# EAGLE design PecanFemto3 (EAGLE 7.3.0)
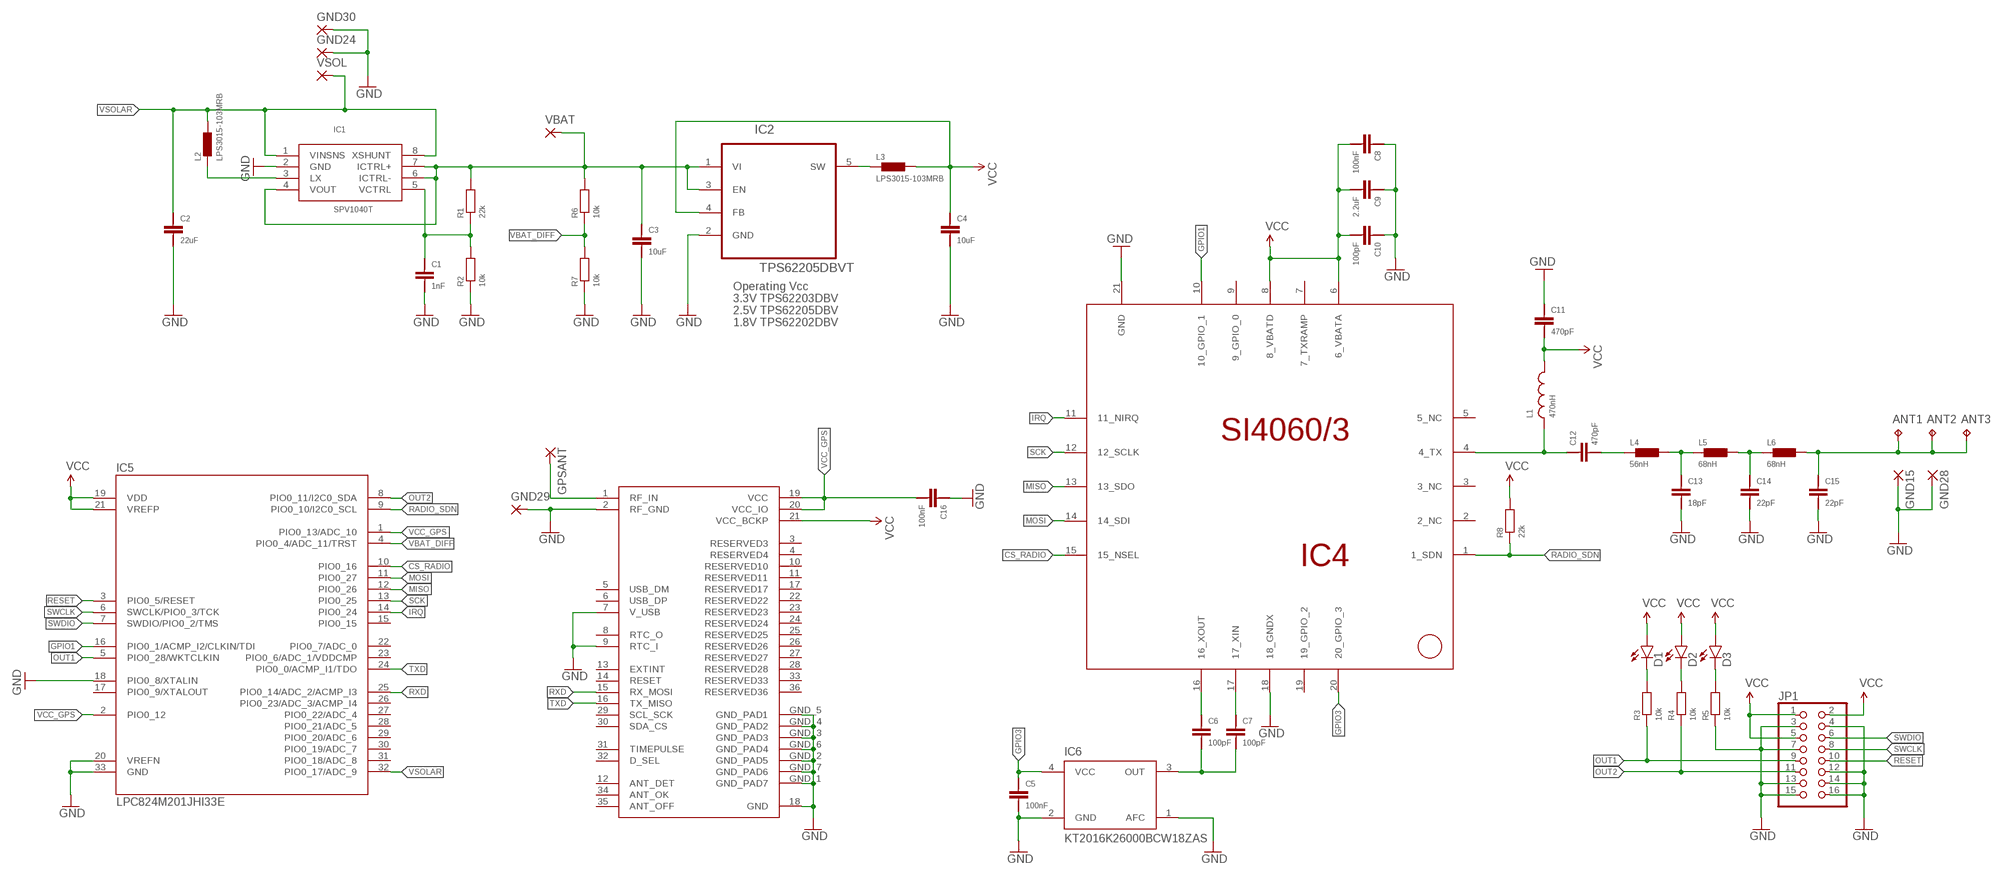
[diagram p0: schematic, sheet 1]

## Parts
ANT1  TP  [P1-7]
ANT2  TP  [P1-7]
ANT3  TP  [P1-7]
C1  1nF  CAP-0402  [0402]
C2  22uF  CAP-0805  [0805]
C3  10uF  CAP-0805  [0805]
C4  10uF  CAP-0805  [0805]
C5  100nF  CAP-0402  [0402]
C6  100pF  CAP-0402  [0402]
C7  100pF  CAP-0402  [0402]
C8  100nF  CAP-0402  [0402]
C9  2.2uF  CAP-0402  [0402]
C10  100pF  CAP-0402  [0402]
C11  470pF  CAP-0402  [0402]
C12  470pF  CAP-0402  [0402]
C13  18pF  CAP-0402  [0402]
C14  22pF  CAP-0402  [0402]
C15  22pF  CAP-0402  [0402]
C16  100nF  CAP-0402  [0402]
D1  LED0603  [LED-0603]
D2  LED0603  [LED-0603]
D3  LED0603  [LED-0603]
GND15  SMD2  [SMD1,27-2,54]
GND24  SMD2  [SMD1,27-2,54]
GND28  SMD2  [SMD1,27-2,54]
GND29  SMD2  [SMD1,27-2,54]
GND30  SMD2  [SMD1,27-2,54]
GPSANT  SMD2  [SMD1,27-2,54]
IC1  SPV1040T  SPV1040  [TSSOP8]
IC2  TPS62205DBVT  TPS62203DBVT  [SOT95P280X145-5N]
IC3  EVA7M  [EVA7M]
IC4  SI4060/3  [QFN-20]
IC5  LPC824M201JHI33E  [QFN65P500X500X100-33N]
IC6  KT2016K26000BCW18ZAS  TXC_7Z  [TCXO_2.0X1.6]
JP1  PINHD-2X8  [2X08]
L1  470nH  INDUCTOR0805  [0805]
L2  LPS3015-103MRB  IND-LPS3015  [LPS3015]
L3  LPS3015-103MRB  IND-LPS3015  [LPS3015]
L4  56nH  IND-0402  [0402]
L5  68nH  IND-0402  [0402]
L6  68nH  IND-0402  [0402]
R1  22k  RES-0402  [0402]
R2  10k  RES-0402  [0402]
R3  10k  RES-0402  [0402]
R4  10k  RES-0402  [0402]
R5  10k  RES-0402  [0402]
R6  10k  RES-0402  [0402]
R7  10k  RES-0402  [0402]
R8  22k  RES-0402  [0402]
VBAT  SMD2  [SMD1,27-2,54]
VSOL  SMD2  [SMD1,27-2,54]

## Nets
C12: C12.P$1 L4.P$1
CS_RADIO: IC4.15(15_NSEL) IC5.10(PIO0_16)
GND: C1.P$1 C2.P$1 C3.P$1 C4.P$1 C5.P$1 C8.P$2 C9.P$2 C10.P$2 C11.P$2 C13.P$1 C14.P$1 C15.P$1 C16.P$2 GND15.1(P) GND24.1(P) GND28.1(P) GND29.1(P) GND30.1(P) IC1.2(GND) IC2.2(GND) IC3.2(RF_GND) IC3.7(V_USB) IC3.9(RTC_I) IC3.18(GND) IC3.GND_1(GND_PAD7) IC3.GND_2(GND_PAD5) IC3.GND_3(GND_PAD3) IC3.GND_4(GND_PAD2) IC3.GND_5(GND_PAD1) IC3.GND_6(GND_PAD4) IC3.GND_7(GND_PAD6) IC4.18(18_GNDX) IC4.21(GND) IC5.18(PIO0_8/XTALIN) IC5.20(VREFN) IC5.33(GND) IC6.1(AFC) IC6.2(GND) JP1.3 JP1.4 JP1.7 JP1.12 JP1.13 JP1.14 JP1.15 JP1.16 R2.P$1 R5.P$1 R7.P$1
GPIO1: IC4.10(10_GPIO_1) IC5.16(PIO0_1/ACMP_I2/CLKIN/TDI)
GPIO3: C5.P$2 IC4.20(20_GPIO_3) IC6.4(VCC)
IRQ: IC4.11(11_NIRQ) IC5.14(PIO0_24)
L5: C13.P$2 L4.P$2 L5.P$1
MISO: IC4.13(13_SDO) IC5.12(PIO0_26)
MOSI: IC4.14(14_SDI) IC5.11(PIO0_27)
N$1: GPSANT.1(P) IC3.1(RF_IN)
N$2: C12.P$2 IC4.4(4_TX) L1.1
N$3: ANT1.TP ANT2.TP ANT3.TP C15.P$2 L6.P$2
N$6: C14.P$2 L5.P$2 L6.P$1
N$7: C7.P$2 IC4.17(17_XIN)
N$8: D1.C R3.P$2
N$9: C6.P$1 C7.P$1 IC6.3(OUT)
N$10: C6.P$2 IC4.16(16_XOUT)
N$11: D2.C R4.P$2
N$12: D3.C R5.P$2
N$14: IC1.3(LX) L2.1_1 L2.1_2 L2.1_3 L2.1_4 L2.1_5 L2.1_6 L2.1_7 L2.1_8 L2.1_9
N$15: IC2.5(SW) L3.1_1 L3.1_2 L3.1_3 L3.1_4 L3.1_5 L3.1_6 L3.1_7 L3.1_8 L3.1_9
N$20: C1.P$2 IC1.5(VCTRL) R1.P$1 R2.P$2
OUT1: IC5.5(PIO0_28/WKTCLKIN) JP1.9 R3.P$1
OUT2: IC5.8(PIO0_11/I2C0_SDA) JP1.11 R4.P$1
RADIO_SDN: IC4.1(1_SDN) IC5.9(PIO0_10/I2C0_SCL) R8.P$1
RESET: IC5.3(PIO0_5/RESET) JP1.10
RXD: IC3.15(RX_MOSI) IC5.25(PIO0_14/ADC_2/ACMP_I3)
SCK: IC4.12(12_SCLK) IC5.13(PIO0_25)
SWCLK: IC5.6(SWCLK/PIO0_3/TCK) JP1.8
SWDIO: IC5.7(SWDIO/PIO0_2/TMS) JP1.6
TXD: IC3.16(TX_MISO) IC5.24(PIO0_0/ACMP_I1/TDO)
VBAT: C3.P$2 IC1.4(VOUT) IC1.6(ICTRL-) IC1.7(ICTRL+) IC2.1(VI) IC2.3(EN) R1.P$2 R6.P$2 VBAT.1(P)
VBAT_DIFF: IC5.4(PIO0_4/ADC_11/TRST) R6.P$1 R7.P$2
VCC: C4.P$2 C8.P$1 C9.P$1 C10.P$1 C11.P$1 D1.A D2.A D3.A IC2.4(FB) IC3.21(VCC_BCKP) IC4.6(6_VBATA) IC4.8(8_VBATD) IC5.19(VDD) IC5.21(VREFP) JP1.1 JP1.2 JP1.5 L1.2 L3.2_1 L3.2_2 L3.2_3 L3.2_4 L3.2_5 L3.2_6 L3.2_7 L3.2_8 L3.2_9 R8.P$2
VCC_GPS: C16.P$1 IC3.19(VCC) IC3.20(VCC_IO) IC5.1(PIO0_13/ADC_10) IC5.2(PIO0_12)
VSOLAR: C2.P$2 IC1.1(VINSNS) IC1.8(XSHUNT) IC5.32(PIO0_17/ADC_9) L2.2_1 L2.2_2 L2.2_3 L2.2_4 L2.2_5 L2.2_6 L2.2_7 L2.2_8 L2.2_9 VSOL.1(P)
Unconnected: IC3.3(RESERVED3) IC3.4(RESERVED4) IC3.5(USB_DM) IC3.6(USB_DP) IC3.8(RTC_O) IC3.10(RESERVED10) IC3.11(RESERVED11) IC3.12(ANT_DET) IC3.13(EXTINT) IC3.14(RESET) IC3.17(RESERVED17) IC3.22(RESERVED22) IC3.23(RESERVED23) IC3.24(RESERVED24) IC3.25(RESERVED25) IC3.26(RESERVED26) IC3.27(RESERVED27) IC3.28(RESERVED28) IC3.29(SCL_SCK) IC3.30(SDA_CS) IC3.31(TIMEPULSE) IC3.32(D_SEL) IC3.33(RESERVED33) IC3.34(ANT_OK) IC3.35(ANT_OFF) IC3.36(RESERVED36) IC4.2(2_NC) IC4.3(3_NC) IC4.5(5_NC) IC4.7(7_TXRAMP) IC4.9(9_GPIO_0) IC4.19(19_GPIO_2) IC5.15(PIO0_15) IC5.17(PIO0_9/XTALOUT) IC5.22(PIO0_7/ADC_0) IC5.23(PIO0_6/ADC_1/VDDCMP) IC5.26(PIO0_23/ADC_3/ACMP_I4) IC5.27(PIO0_22/ADC_4) IC5.28(PIO0_21/ADC_5) IC5.29(PIO0_20/ADC_6) IC5.30(PIO0_19/ADC_7) IC5.31(PIO0_18/ADC_8)

## Notes on the sheet
- Operating Vcc
  3.3V TPS62203DBV
  2.5V TPS62205DBV
  1.8V TPS62202DBV

## Library data of the parts
ANT1-ANT3 = testpad:TP: Test pad; MPN: ERJ-3EKF62R0V; OC_NEWARK: 53W4658
C1 C5-C16 = sven:CAP-0402; OC_NEWARK: unknown
C2-C4 = sven:CAP-0805; OC_NEWARK: unknown
D1-D3 = SparkFun-LED:LED: LEDs Standard schematic elements and footprints for 5mm, 3mm, 1206, and 0603 sized LEDs. 5mm - Spark Fun Electronics SKU : COM-00529 (and others); OC_NEWARK: unknown
GND15 GND24 GND28-GND30 GPSANT VBAT VSOL = PecanFemto4:SMD2: SMD PAD; OC_NEWARK: unknown
IC1 = PecanPico6:SPV1040; OC_NEWARK: unknown
IC2 = TPS62203:TPS62203DBVT: HIGH-EFFICIENCY, SOT23 STEP-DOWN, DC-DC CONVERTER; MF: TEXAS INSTRUMENTS; MPN: TPS62203DBVT; OC_FARNELL: 8458049; OC_NEWARK: 36K7662; PACKAGE: SOT-23-5; SUPPLIER: Texas Instruments
IC3 = eva7m:EVA7M; OC_NEWARK: unknown
IC4 = PecanFemto4:SI4060/3; OC_NEWARK: unknown
IC5 = PecanPico6:LPC824M201JHI33E; OC_NEWARK: unknown
IC6 = tcxo:TXC_7Z
JP1 = pinhead:PINHD-2X8: PIN HEADER; OC_NEWARK: unknown
L1 = LPC1114_RefDesign_v1.3:INDUCTOR: Inductors 0603: 10nH Ceramic Inductor - microwire antenna/RF (Digikey: 712-1434-2-ND) 0805: 560nH Ceramic Inductor - RF (Digikey: 553-1047-1-ND) 1007 (2518 Metric) SMT: 10µH 10% 250mOhm 820mA 1007 Inductor (Digikey: 587-2189-1-ND) 22µH 10% 500mOhm 580mA 1007 Inductor (Digikey: 587-2190-1-ND) 47µH 10% 950mOhm 420mA 1007 Inductor (Digikey: 587-2191-1-ND); OC_NEWARK: unknown
L2 L3 = PecanPico6:IND-LPS3015; OC_NEWARK: unknown
L4-L6 = sven:IND-0402; OC_NEWARK: unknown
R1-R8 = PecanPico6:RES-0402; OC_NEWARK: unknown

## Board
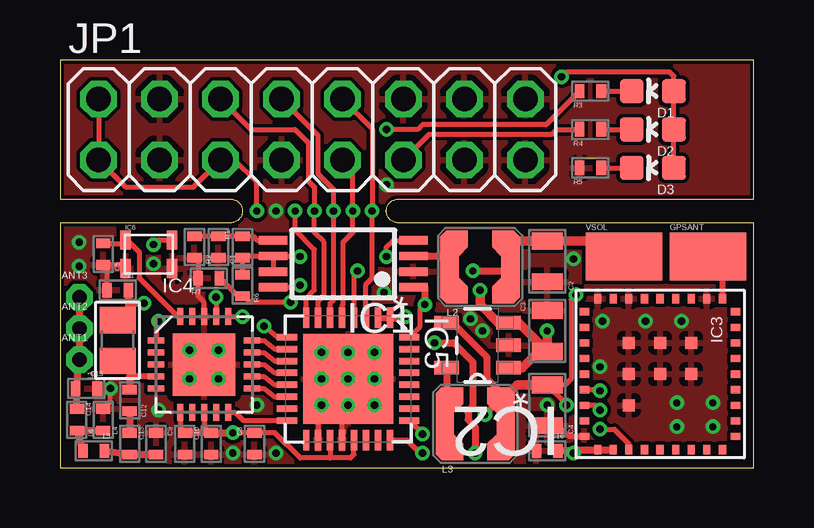
[diagram p1: board, top side]
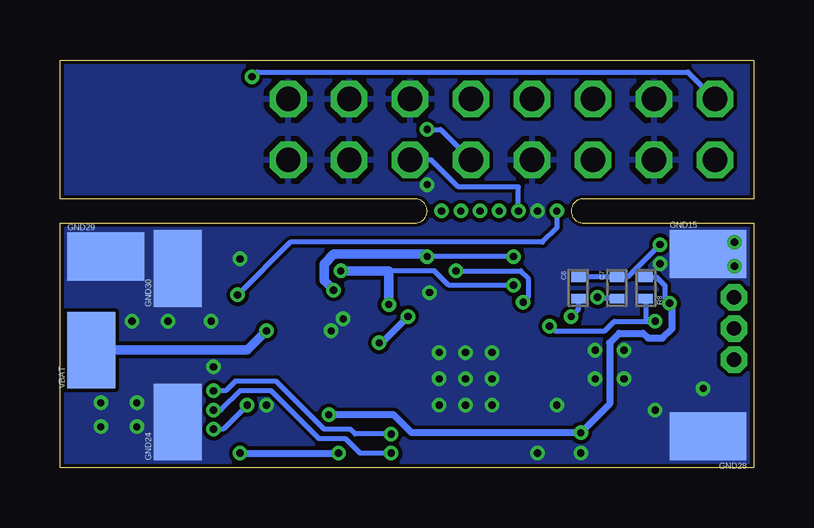
[diagram p2: board, bottom side, seen from below]

Size 28.9 x 17 mm. Coordinates in mm from the lower left corner, seen from the top.
Outline: 0,0 28.9,0 28.9,10.2 14.1,10.2 arc-90 13.6,10.7 arc-90 14.1,11.2 28.9,11.2 28.9,17 0,17 0,11.2 7.1,11.2 arc-90 7.6,10.7 arc-90 7.1,10.2 0,10.2 0,0
Copper layers (1*16): Top 0.035mm / dielectric 1.5mm / Bottom 0.035mm
Design rules "hackvana": minimum track width 6mil, minimum drill 0.3mm, track to track 6mil, track to pad 6mil, pad to pad 6mil, via to via 6mil, smd to smd 0mil, copper to edge 6mil, drill to drill 6mil, minimum pad ring 10mil, minimum via ring 6mil, stop-mask expansion 2mil, vias tented up to drill 100mil, thermal gap 10mil

### Footprints (pad centres in the part's own frame; a part is rotated, then mirrored left to right if it is on the bottom)
P1-7 = drill 0.6 octagon: TP 0,0
0402 = smd 0.4 x 0.6: P$1 -0.45,0; P$2 0.45,0
0805 = smd 0.7 x 1.3: P$1 -0.85,0; P$2 0.85,0
LED-0603 = smd 1 x 1: A 0,-0.877; C 0,0.877
SMD1,27-2,54 = smd 2 x 3.2: 1 0,0
TSSOP8 = smd 1.2 x 0.35: 1 -2.925,0.975; 2 -2.925,0.325; 3 -2.925,-0.325; 4 -2.925,-0.975; 5 2.925,-0.975; 6 2.925,-0.325; 7 2.925,0.325; 8 2.925,0.975
SOT95P280X145-5N = smd 1.016 x 0.559: 1 -1.295,0.94; 2 -1.295,0; 3 -1.295,-0.94; 4 1.295,-0.94; 5 1.295,0.94
EVA7M = smd 0.4 x 0.3: 1 -3.15,2.6; 2 -3.15,1.95; 3 -3.15,1.3; 4 -3.15,0.65; 5 -3.15,0; 6 -3.15,-0.65; 7 -3.15,-1.3; 8 -3.15,-1.95; 9 -3.15,-2.6; 19 3.15,-2.6; 20 3.15,-1.95; 21 3.15,-1.3; 22 3.15,-0.65; 23 3.15,0; 24 3.15,0.65; 25 3.15,1.3; 26 3.15,1.95; 27 3.15,2.6 | smd 0.3 x 0.4: 10 -2.6,-3.15; 11 -1.95,-3.15; 12 -1.3,-3.15; 13 -0.65,-3.15; 14 0,-3.15; 15 0.65,-3.15; 16 1.3,-3.15; 17 1.95,-3.15; 18 2.6,-3.15; 28 2.6,3.15; 29 1.95,3.15; 30 1.3,3.15; 31 0.65,3.15; 32 0,3.15; 33 -0.65,3.15; 34 -1.3,3.15; 35 -1.95,3.15; 36 -2.6,3.15 | smd 0.5 x 0.5: GND_1 -1.3,1.3; GND_2 -1.3,0; GND_3 -1.3,-1.3; GND_4 0,-1.3; GND_5 1.3,-1.3; GND_6 0,0; GND_7 0,1.3
QFN-20 = smd 0.7 x 0.25: 1 -2,1; 2 -2,0.5; 3 -2,0; 4 -2,-0.5; 5 -2,-1; 11 2,-1; 12 2,-0.5; 13 2,0; 14 2,0.5; 15 2,1 | smd 0.25 x 0.7: 6 -1,-2; 7 -0.5,-2; 8 0,-2; 9 0.5,-2; 10 1,-2; 16 1,2; 17 0.5,2; 18 0,2; 19 -0.5,2; 20 -1,2 | smd 2.6 x 2.6: 21 0,0
QFN65P500X500X100-33N = smd 0.85 x 0.27: 1 -2.55,1.74; 2 -2.55,1.242; 3 -2.55,0.746; 4 -2.55,0.248; 5 -2.55,-0.248; 6 -2.55,-0.746; 7 -2.55,-1.242; 8 -2.55,-1.74; 17 2.55,-1.74; 18 2.55,-1.242; 19 2.55,-0.746; 20 2.55,-0.248; 21 2.55,0.248; 22 2.55,0.746; 23 2.55,1.242; 24 2.55,1.74 | smd 0.27 x 0.85: 9 -1.74,-2.55; 10 -1.242,-2.55; 11 -0.746,-2.55; 12 -0.248,-2.55; 13 0.248,-2.55; 14 0.746,-2.55; 15 1.242,-2.55; 16 1.74,-2.55; 25 1.74,2.55; 26 1.242,2.55; 27 0.746,2.55; 28 0.248,2.55; 29 -0.248,2.55; 30 -0.746,2.55; 31 -1.242,2.55; 32 -1.74,2.55 | smd 3.75 x 3.75: 33 0,0
TCXO_2.0X1.6 = smd 0.44 x 0.79: 1 -0.97,-0.595; 2 0.97,-0.595; 3 0.97,0.595; 4 -0.97,0.595
2X08 = drill 1.016 octagon: 1 -8.89,-1.27; 2 -8.89,1.27; 3 -6.35,-1.27; 4 -6.35,1.27; 5 -3.81,-1.27; 6 -3.81,1.27; 7 -1.27,-1.27; 8 -1.27,1.27; 9 1.27,-1.27; 10 1.27,1.27; 11 3.81,-1.27; 12 3.81,1.27; 13 6.35,-1.27; 14 6.35,1.27; 15 8.89,-1.27; 16 8.89,1.27
0805' = smd 1.1 x 1.5: 1 -0.85,0; 2 0.85,0
LPS3015 = smd 0.762 x 2.54: 1_1 -1.27,0; 2_1 1.27,0 | smd 0.889 x 0.254: 1_2 -0.953,-1.397; 1_3 -0.953,1.397; 2_2 0.953,-1.397; 2_3 0.953,1.397 | smd 0.381 x 0.445: 1_4 -0.699,-1.048; 1_5 -0.699,1.048; 2_4 0.699,-1.048; 2_5 0.699,1.048 | smd 0.359 x 0.359 rotated 45: 1_6 -1.398,-1.271; 1_7 -1.398,1.271 | smd 0.538 x 0.538 rotated 45: 1_8 -0.889,-0.823; 1_9 -0.889,0.823 | smd 0.359 x 0.359 rotated 225: 2_6 1.398,-1.271; 2_7 1.398,1.271 | smd 0.538 x 0.538 rotated 225: 2_8 0.889,-0.823; 2_9 0.889,0.823

### Placement (x,y rotation side)
ANT1  0.81,4.5 0 top
ANT2  0.81,5.8 0 top
ANT3  0.81,7.1 0 top
C1  6.6,9.2 90 top
C2  20.3,8.6 90 top
C3  20.3,5.7 270 top
C4  20.3,2.6 90 top
C5  1.8,8.9 90 top
C6  7.3,7.5 270 bottom
C7  5.7,7.5 270 bottom
C8  8.1,1 270 top
C9  5.2,1 270 top
C10  6.3,1 270 top
C11  2.4,7.4 180 top
C12  2.9,2.8 90 top
C13  4,1 270 top
C14  1.8,2 270 top
C15  1.1,3.3 180 top
C16  20.3,0.7 180 top
D1  24.7,15.7 90 top
D2  24.7,14.1 90 top
D3  24.7,12.5 90 top
GND15  1.9,8.9 270 bottom
GND24  24,1.9 0 bottom
GND28  1.9,1.3 90 bottom
GND29  27,8.8 270 bottom
GND30  24,8.3 0 bottom
GPSANT  27,8.8 270 top
IC1  11.8,8.5 180 top
IC2  17.4,5.1 180 top
IC3  25,3.9 270 top
IC4  6,4.3 0 top
IC5  12,3.7 270 top
IC6  3.7,8.9 0 top
JP1  10.5,14.1 0 top
L1  470nH  [0805']  2.4,5.3 90 top
L2  17.5,8.37 0 top
L3  17.3,1.83 0 top
L4  2.9,1 270 top
L5  1.4,0.7 180 top
L6  0.7,2 90 top
R1  7.6,9.2 270 top
R2  5.6,9.2 90 top
R3  22.1,15.7 0 top
R4  22.1,14.1 0 top
R5  22.1,12.5 0 top
R6  7.6,7.6 90 top
R7  6.2,7.9 0 top
R8  4.5,7.5 90 bottom
VBAT  27.6,4.9 0 bottom
VSOL  23.5,8.8 270 top

### Tracks (layer width: path | path; a pad name or v marks a point on that pad's centre or on a via)
C12
  Top 0.3: C12.P$1 L4.P$1
CS_RADIO
  Top 0.2: IC4.15 8.5,5.3 8.96,4.94 IC5.10
GND  (via drill 0.3)
  Top 0.2: v5.4,3.7 IC4.21 v6.6,4.9 | IC5.18 10.76,2.6 v10.9,2.6 11.75,2.6 IC5.20 | C4.P$1 20.75,1.75 21.2,1.3 IC3.18 | C14.P$1 2.1,2.75 v2.1,3.3 | R2.P$1 5.75,8.6 R7.P$1 5.75,7.15 6,6.9 IC4.18 | IC6.1 2.59,8.45 C5.P$1 1.95,8.3 C11.P$2
  other vias: 5.4,4.9 6.6,3.7 4.1,2.4 7.2,0.6 9,0.6 12,3.7 12,2.6 13.1,3.7 13.1,2.6 12,4.8 10.9,3.7 10.9,4.8 13.1,4.8 21.4,8.7 13.5,7.3 20.3,2.6 8.2,2.6 17.6,5.7 9,10.7 25.7,1.7 27.2,1.7 27.2,2.7 25.7,2.7 22.5,4.2 22.6,6.1 17.1,6.2 13.6,11.8 25.9,6.1 24.4,6.1 0.8,9.4 0.8,8.4 3.9,8.5
  pour Top: 0,10.2 7.1,10.2 arc90 7.6,10.7 arc90 7.1,11.2 0,11.2 0,17 28.9,17 28.9,11.2 14.1,11.2 arc90 13.6,10.7 arc90 14.1,10.2 28.9,10.2 28.9,0 0,0
  pour Bottom: 0,10.2 7.1,10.2 arc90 7.6,10.7 arc90 7.1,11.2 0,11.2 0,17 28.9,17 28.9,11.2 14.1,11.2 arc90 13.6,10.7 arc90 14.1,10.2 28.9,10.2 28.9,0 0,0
GPIO1
  Top 0.2: IC4.10 7.3,2.3 7.64,1.96 IC5.16
GPIO3
  Top 0.2: C5.P$2 2.73,9.35 | 2.73,9.35 IC6.4 | 2.73,9.35 2.95,9.35 3.3,9 3.3,7.9 4.9,6.3 IC4.20
IRQ
  Top 0.2: IC4.11 8.5,3.3 8.95,2.95 IC5.14
L5
  Top 0.3: C13.P$2 L4.P$2 L5.P$1
MISO
  Top 0.2: IC4.13 8.5,4.3 8.95,3.95 IC5.12
MOSI
  Top 0.2: IC4.14 8.5,4.8 8.95,4.45 IC5.11
N$1
  Top 0.25: GPSANT.1 27.6,8.8 IC3.1
N$2
  Top 0.25: IC4.4 2.9,3.8
  Top 0.3: L1.1 2.9,3.95 2.9,3.8 C12.P$2
N$3
  Top 0.3: L6.P$2 C15.P$2 ANT1.TP ANT2.TP ANT3.TP
N$6
  Top 0.3: L5.P$2 L6.P$1 C14.P$2
N$7  (via drill 0.3)
  Top 0.2: v6.5,7.1 IC4.17
  Bottom 0.2: C7.P$2 6.45,7.05 v6.5,7.1
N$8
  Top 0.2: R3.P$2 D1.C
N$9  (via drill 0.3)
  Top 0.2: v3.9,9.3 4.1,9.5 IC6.3
  Bottom 0.2: v3.9,9.3 5.25,7.95 C7.P$1 C6.P$1
N$10  (via drill 0.3)
  Top 0.2: IC4.16 v7.6,6.3
  Bottom 0.2: C6.P$2 7.3,6.6 v7.6,6.3
N$11
  Top 0.2: R4.P$2 D2.C
N$12
  Top 0.2: R5.P$2 D3.C
N$14
  Top 0.2: L2.1_6 L2.1_2 L2.1_4 L2.1_8 L2.1_1 | 16.23,8.82 L2.1_9 L2.1_5 L2.1_3 L2.1_7
  Top 0.3: IC1.3 16.23,8.82 L2.1_1
N$15
  Top 0.2: L3.1_6 L3.1_2 L3.1_4 L3.1_8 L3.1_1 L3.1_9 L3.1_5 L3.1_3 L3.1_7
  Top 0.3: IC2.5 16.11,3.26 L3.1_9
N$20
  Top 0.2: R2.P$2 C1.P$2 R1.P$1 8.05,9.65 8.23,9.48 IC1.5
OUT1  (via drill 0.3)
  Top 0.2: IC5.5 11.75,6.75 11.8,6.8 11.8,9.4 12.2,9.8 v12.2,10.7 12.2,12.4 JP1.9 | R3.P$1 20.25,14.3 15.1,14.3 14.9,14.1 v13.6,14.1
  Bottom 0.2: v13.6,14.1 13.04,14.1 JP1.9
OUT2  (via drill 0.3)
  Top 0.2: IC5.8 10.26,7.06 10.6,7.4 10.6,9.1 9.8,9.9 v9.8,10.7 | JP1.11 15.38,13.9 20.5,13.9 20.7,14.1 R4.P$1
  Bottom 0.2: v9.8,10.7 9.8,11.7 12.3,11.7 13.43,12.83 JP1.11
RADIO_SDN  (via drill 0.3)
  Top 0.2: v4.1,6.1 4,6 IC4.1 | v8.5,5.9 9.06,5.44 IC5.9
  Bottom 0.2: v8.5,5.9 8.3,5.7 6.2,5.7 5.8,6.1 4.5,6.1 | R8.P$1 4.5,6.1 | 4.5,6.1 v4.1,6.1
RESET  (via drill 0.3)
  Top 0.2: IC5.3 12.75,7.64 13,7.9 v13,10.7 13,14.14 JP1.10
RXD  (via drill 0.3)
  Top 0.2: v22.5,3.2 22.45,3.25 IC3.15 | IC5.25 v15.11,1.4 v15.1,1.4
  Bottom 0.2: v15.1,1.4 16.6,1.4 16.8,1.6 17.9,1.6 19.9,3.6 21.6,3.6 22,3.2 v22.5,3.2
SCK
  Top 0.2: IC4.12 8.5,3.8 8.95,3.45 IC5.13
SWCLK  (via drill 0.3)
  Top 0.2: IC5.6 11.25,6.86 11.4,7 v11.4,10.7 11.4,11.6 10.75,12.25 10.75,13.85 JP1.8
SWDIO  (via drill 0.3)
  Top 0.2: IC5.7 10.76,6.96 11,7.2 11,9.4 10.6,9.8 v10.6,10.7 10.6,11.7 10.35,11.95 10.35,13.55 9.8,14.1 7.96,14.1 JP1.6
TXD  (via drill 0.3)
  Top 0.2: v22.5,2.4 22.3,2.6 IC3.16 | IC5.24 14.45,1.15 15,0.6 v15.1,0.6
  Bottom 0.2: v15.1,0.6 16.4,0.6 17,1.2 18.1,1.2 20.1,3.2 21.4,3.2 22.2,2.4 v22.5,2.4
VBAT  (via drill 0.3)
  Top 0.2: IC1.6 7.6,8.82 R1.P$2 R6.P$2 | IC1.6 IC1.7 | v13.6,8.8 13.6,9.2 13.88,9.48 IC1.4 | IC1.6 9.98,8.82 v10,8.8
  Top 0.3: 19.95,4.85 C3.P$2
  Top 0.4: IC2.1 19.26,4.16 19.95,4.85 | v17.5,7.4 17.5,6.8 18.26,6.04 IC2.3 19.11,6.04 C3.P$2 v20.3,5.7
  Bottom 0.2: 13.5,8.9 v13.6,8.8 v10,8.8
  Bottom 0.4: v17.5,7.4 17.9,7.8 17.9,8.5 17.5,8.9 13.7,8.9 v13.6,8.8 | v20.3,5.7 21.1,4.9 VBAT.1
VBAT_DIFF  (via drill 0.3)
  Top 0.2: v12.4,8.2 12.25,8.05 IC5.4 | R7.P$2 7.4,7.15 R6.P$1 7.65,7.15 7.9,6.9 v9.6,6.9
  Bottom 0.2: v12.4,8.2 9.7,8.2 9.4,7.9 9.4,7.1 v9.6,6.9
VCC  (via drill 0.3)
  Top 0.2: IC4.6 5,1.45 C9.P$1 | IC4.8 6,1.45 C10.P$1 | v22.5,1.6 23.1,1.6 23.7,1 IC3.21 | L3.2_7 L3.2_3 L3.2_5 L3.2_9 L3.2_1 L3.2_8 L3.2_4 L3.2_2 L3.2_6 | IC5.21 12.25,0.55 12.1,0.4 11.25,0.4 | v7.2,1.45 C8.P$1 8.95,1.45 10,0.4 11.25,0.4 | IC5.19 11.25,0.4 | v8.2,10.7 8.2,11.9 7.27,12.83 JP1.5 5.56,11.7 2.74,11.7 JP1.1 JP1.2 | v21.1,2.6 21.1,2.65 C4.P$2 21.05,3.45 21.3,3.7 21.3,7 v21.5,7.2 | v20.9,16.3 21.1,16.5 25.4,16.5 25.58,16.32 D1.A D2.A D3.A
  Top 0.3: 6,1.45 C9.P$1 | C10.P$1 v7.2,1.45 | L3.2_5 18.2,3.3 17.8,3.7 17.8,4.6 16.41,6 16.11,6 IC2.4 | v17.7,2.2 18.15,2.65 L3.2_9 | C11.P$1 2.85,6.85 | 2.85,6.85 2.85,6.15 L1.2 | v3.5,6.85 2.85,6.85
  Top 0.4: C4.P$2 19.05,3.45 L3.2_7
  Bottom 0.2: v21.1,2.6 22.1,1.6 v22.5,1.6 | v20.9,16.3 20.7,16.5 2.74,16.5 JP1.2 | v8.2,10.7 8.2,10 8.8,9.4 19.3,9.4 v21.5,7.2 | R8.P$2 4.05,7.95 3.7,7.6 3.7,7.05 v3.5,6.85
  Bottom 0.29: 6,5.2 6,2.65
  Bottom 0.3: 6,2.65 v7.2,1.45 14.25,1.45 15,2.2 v17.7,2.2 | 6,5.2 5.6,5.6 4.6,5.6 4.4,5.4 3.8,5.4 3.4,5.8 3.4,6.75 v3.5,6.85
VCC_GPS  (via drill 0.3)
  Top 0.25: IC5.2 IC5.1
  Top 0.3: IC5.1 14.35,6.25 v14.4,6.3 | C16.P$1 21.3,0.7 v21.4,0.6 21.55,0.75 IC3.19 IC3.20 | v15.6,5.2 16.4,5.2 17.2,4.4 17.2,2.6 17,2.3 17,2 17.3,1.7 v17.3,0.6
  Bottom 0.3: v21.4,0.6 v17.3,0.6 | v15.6,5.2 15.5,5.2 v14.4,6.3
VSOLAR  (via drill 0.3)
  Top 0.2: IC5.32 15,5.89 15,6.6 v15.2,6.8 | L2.2_7 18.8,9.45 | 18.55,9.45 L2.2_3 | L2.2_5 L2.2_9 L2.2_1 L2.2_8 L2.2_4 L2.2_2 L2.2_6 | IC1.8 9.93,7.52 v10,7.6
  Top 0.3: 14.7,7.52 IC1.1 15.2,7.52 v15.2,6.8 | v17.2,8.2 18.64,8.2 L2.2_1
  Top 0.4: L2.2_9 arc-90 18.55,9.45 18.8,9.45 C2.P$2 23.6,9.45 VSOL.1
  Bottom 0.2: v10,7.6 12.7,7.6 13.3,8.2 15.2,8.2
  Bottom 0.4: v15.2,6.8 15.2,8.2 v17.2,8.2

### Text on the board
tDocu: OUT1 | OUT2 | VCC
bDocu: Pecan / Femto3b | 2015-Oct | XIN | XOUT | GND | GND | GND | GND | VBAT | GND | FLY FAR!